# Altium project PCB_Project.PrjPcb
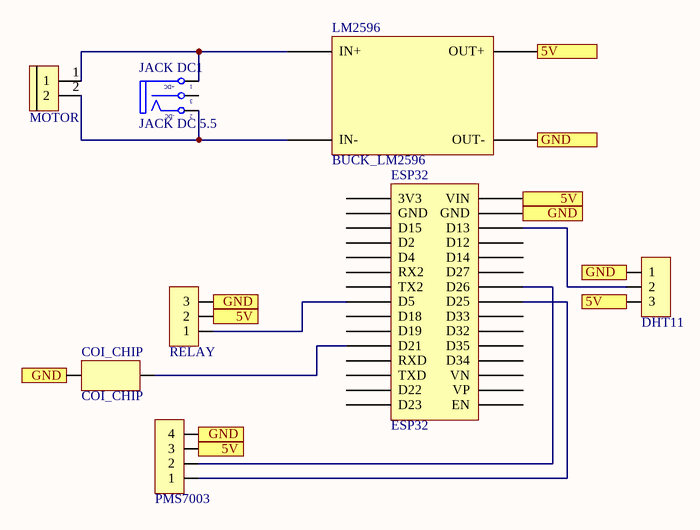
[diagram p0: BAO_CHAY_SCHEMATIC.SchDoc]
1 sheet, 8 parts. Net scope: flat (ports and power ports of the same name join across sheets).
Board file: PCB1.PcbDoc

## Sheet BAO_CHAY_SCHEMATIC.SchDoc
size A; SheetNumber: 1; SheetTotal: 1

### Parts
COI_CHIP  COI_CHIP  [COI_CHIP - duplicate]
DHT11  DHT11  [JP 1x3 CT]  (value not drawn)
ESP32  ESP32  [ESP32]
JACK_DC1  JACK DC 5.5  [JACK DC 5.5]
LM2596  BUCK_LM2596  [DIP4]
MOTOR  MOTOR  [Con 2 KF301 5.08]  (value not drawn)
PMS7003  PMS7003  [JP 1x4 CC]  (value not drawn)
RELAY  RELAY  [JP 1x3 CT]  (value not drawn)

### Ports
5V (in), 5V (out), GND (in), GND (out)

### Nets
NetCOI_CHIP_1: COI_CHIP.1 DHT11.1 ESP32.29(GND) LM2596.3(OUT-) PMS7003.4 RELAY.3 ; port GND
NetCOI_CHIP_2: COI_CHIP.2 ESP32.11(D21)
NetDHT11_2: DHT11.2 ESP32.28(D13)
NetDHT11_3: DHT11.3 ESP32.30(VIN) LM2596.4(OUT+) PMS7003.3 RELAY.2 ; port 5V
NetESP32_8: ESP32.8(D5) RELAY.1
NetESP32_23: ESP32.23(D25) PMS7003.1
NetESP32_24: ESP32.24(D26) PMS7003.2
NetJACK_DC1_1: JACK_DC1.1(T) LM2596.1(IN+) MOTOR.1
NetJACK_DC1_2: JACK_DC1.2(TN) LM2596.2(IN-) MOTOR.2

Not connected (* = marked no-connect by the designer): ESP32 1(3V3) 2(GND) 3(D15) 4(D2) 5(D4) 6(RX2) 7(TX2) 9(D18) 10(D19) 12(RXD) 13(TXD) 14(D22) 15(D23) 16(EN) 17(VP) 18(VN) 19(D34) 20(D35) 21(D32) 22(D33) 25(D27) 26(D14) 27(D12); JACK_DC1 3(S)

### Notes on the sheet
- (in symbol JACK DC 5.5) +DC; -DC

### Library data of the parts
DHT11 RELAY = JP 1x3 2.54 Cai Thang: Cắm; Ten_Linh_Kien: Jump Đơn Cái 2.54MM 1x20P Thẳng; Don_Vi: Con; Ma_Hang: MH004006; Ghi_Chu: *; Kieu_Chan: *; Chung_Loai: Cắm
JACK_DC1 = JACK DC 5.5: Value: Jac DC
MOTOR = CON 2 KF301: Cắm; Ma_Hang: MH000987; Ten_Linh_Kien: CON 2 KF301-2P 5.08MM Xanh Dương; Don_Vi: Con; Chung_Loai: Cắm; Ghi_Chu: *; Kieu_Chan: *
PMS7003 = JP 1x4 2.54 Cai Cong: Cắm; Ten_Linh_Kien: Jump Đơn Cái 2.54MM 1x40P Cong; Don_Vi: Con; Ma_Hang: MH001265; Ghi_Chu: *; Kieu_Chan: *; Chung_Loai: Cắm